# Altium schematic sheet dc_motor.SchDoc
size A4
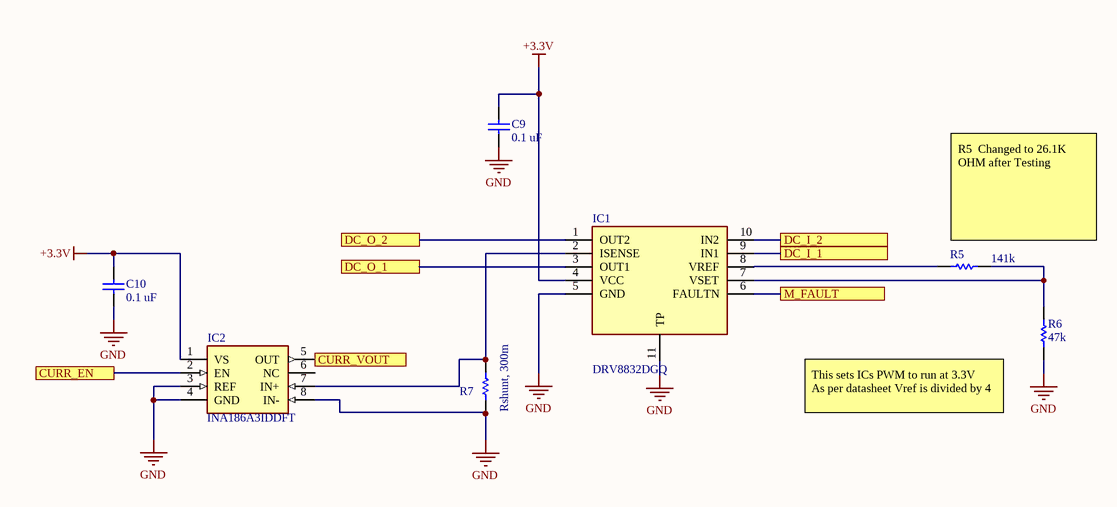
[diagram p0: dc_motor.SchDoc]

## Parts
C9  0.1 uF  [CAPC2013X145X50LL20T25]
C10  0.1 uF  [CAPC2013X145X50LL20T25]
IC1  DRV8832DGQ  [SOP50P490X110-11N]
IC2  INA186A3IDDFT  [SOT65P280X110-8N]
R5  141k  [RESC2013X60X35NL10T20]
R6  47k  [RESC2013X60X35NL10T20]
R7  Rshunt, 300m  [RESC3116X65X40ML10T20]

## Ports
CURR_EN, CURR_VOUT, DC_I_1, DC_I_2, DC_O_1, DC_O_2, M_FAULT

## Nets
+3.3V: C9.2 C10.2 IC1.4(VCC) IC2.1(VS)
GND: C9.1 C10.1 IC1.5(GND) IC1.11(TP) IC2.3(REF) IC2.4(GND) IC2.8(IN-) R6.1 R7.1
CURR_EN: IC2.2(EN) ; port CURR_EN
CURR_VOUT: IC2.5(OUT) ; port CURR_VOUT
DC_I_1: IC1.9(IN1) ; port DC_I_1
DC_I_2: IC1.10(IN2) ; port DC_I_2
DC_O_1: IC1.3(OUT1) ; port DC_O_1
DC_O_2: IC1.1(OUT2) ; port DC_O_2
M_FAULT: IC1.6(FAULTN) ; port M_FAULT
NetIC1_2: IC1.2(ISENSE) IC2.7(IN+) R7.2
NetIC1_7: IC1.7(VSET) R5.1 R6.2
NetIC1_8: IC1.8(VREF) R5.2

Not connected (* = marked no-connect by the designer): IC2 6(NC)

## Notes on the sheet
- (near R5) R5  Changed to 26.1K OHM after Testing
- (near R6) This sets ICs PWM to run at 3.3V
  As per datasheet Vref is divided by 4

## Library data of the parts
C9 C10 = CMP-2007-01258-1: Manufacturer: Kemet; Part Number: C0805C104Z5VACTU
IC1 = DRV8832DGQ: Integrated Circuit; Manufacturer_Name: Texas Instruments; Datasheet Link: http://datasheet.octopart.com/DRV8832DGQ-Texas-Instruments-datasheet-10258026.pdf; Height: 1.1mm; Manufacturer_Part_Number: DRV8832DGQ; Arrow Part Number: DRV8832DGQ; Arrow Price/Stock: https://www.arrow.com/en/products/drv8832dgq/texas-instruments; Mouser Part Number: 595-DRV8832DGQ; Mouser Price/Stock: https://www.mouser.co.uk/ProductDetail/Texas-Instruments/DRV8832DGQ?qs=O1HRStiETChGrPfF5MJfDw%3D%3D
IC2 = INA186A3IDDFT: Integrated Circuit; Manufacturer_Name: Texas Instruments; Datasheet Link: https://www.ti.com/lit/ds/symlink/ina186.pdf?ts=1591829586496&ref_url=https://www.ti.com/product/INA186; Height: 1.45mm; Manufacturer_Part_Number: INA186A3IDDFT; Arrow Part Number: INA186A3IDDFT
R5 = CMP-1659-00011-4: ERJ-6ENF1403V 141K; Manufacturer: Yageo; Voltage Rating: 150 V; Height: 0.5 mm; ComponentLink2URL: http://www.yageo.com/documents/recent/PYu-RC_Group_51_RoHS_L_04.pdf; ComponentLink2Description: Datasheet; Package Quantity: 200; Max Operating Temperature: 155 degC; Min Operating Temperature: -55 degC; Packaging: Tape and Reel; Pins: 2; PackageReference: 0805; Mounting Technology: Surface Mount; ComponentLink1Description: Manufacturer URL; ComponentLink1URL: http://www.yageo.com/; PackageDescription: 2-Pin Surface Mounted Device, Body 2 x 1.25 mm; Length: 2 mm; REACH SVHC: No SVHC; Mount: Surface Mount; RoHSCompliant: true; DatasheetVersion: Rev. 4, 02/2016
R6 = CMP-1659-00011-4: Chip Resistor, 47 KOhm, +/- 1%, 0.125 W, -55 to 155 degC, 0805 (2012 Metric), RoHS, Tape and Reel, RC0805FR-0747KL; Manufacturer: Yageo; Voltage Rating: 150 V; Height: 0.5 mm; ComponentLink2URL: http://www.yageo.com/documents/recent/PYu-RC_Group_51_RoHS_L_04.pdf; ComponentLink2Description: Datasheet; Package Quantity: 200; Max Operating Temperature: 155 degC; Min Operating Temperature: -55 degC; Packaging: Tape and Reel; Pins: 2; PackageReference: 0805; Mounting Technology: Surface Mount; ComponentLink1Description: Manufacturer URL; ComponentLink1URL: http://www.yageo.com/; PackageDescription: 2-Pin Surface Mounted Device, Body 2 x 1.25 mm; Length: 2 mm; REACH SVHC: No SVHC; Mount: Surface Mount; RoHSCompliant: true; DatasheetVersion: Rev. 4, 02/2016
R7 = CMP-2100-03678-1: CSR1206FKR300 / RES 0.3 OHM 1% 1/2W 1206; Manufacturer: Yageo; Temperature Coefficient: 100ppm/degreesC; Power Rating: 250mW; Voltage Rating: 200V; Resistance: 1KOhm; Composition: ThickFilm; Min Operating Temperature: -55degC; Tolerance: 1%; REACH SVHC: Unknown; Case Code (Metric): 3216; Military Standard: Not; Datasheet Version: Rev. 5, 10/2016; Package Reference: 1206.0; Case/Package: 1206; Length: 3.1mm; Manufacturer URL: http://www.yageo.com/; Lead Free: LeadFree; RoHSCompliant: true; Termination: SMD/SMT; Packaging: TapeandReel; Package Description: 2-Pin Surface Mount Device, Body 3.1 x 1.6 mm; Depth: 1.6mm; Case Code (Imperial): 1206; Max Operating Temperature: 155degC; Datasheet URL: http://www.yageo.com/NewPortal/yageodocoutput?fileName=/pdf/R-Chip/PYu-RC_Group_51_RoHS_L_5.pdf; Height: 0.55mm